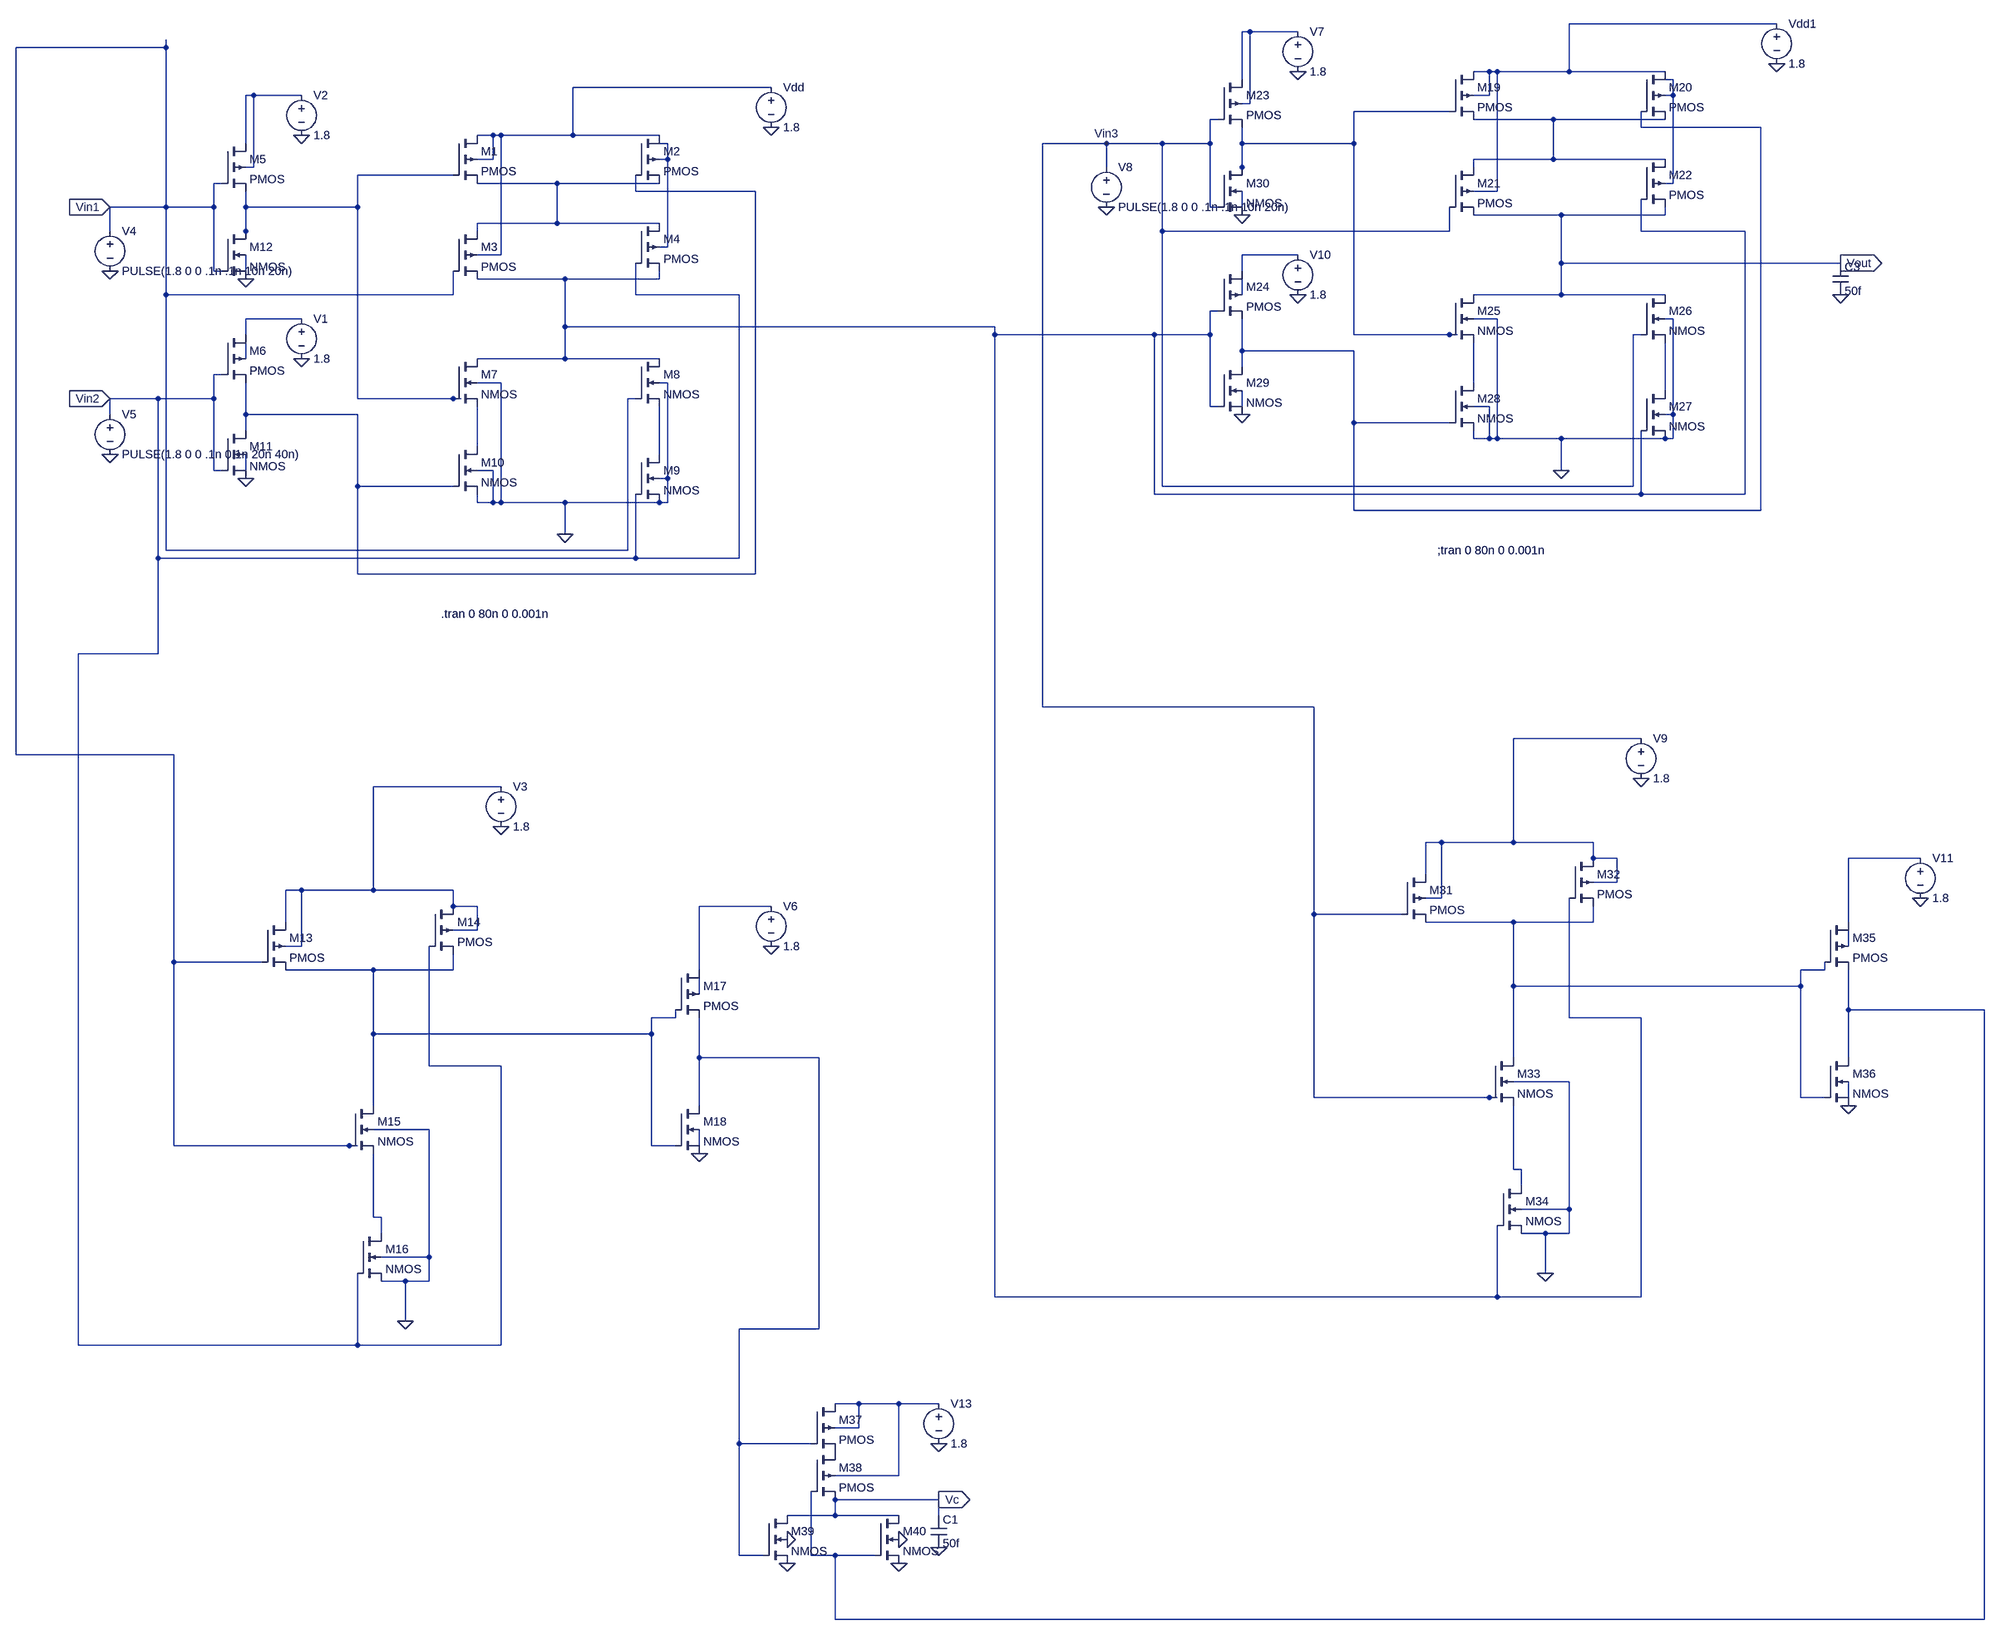
[diagram p0: schematic full_adder.asc]
full_adder.asc, the LTspice schematic file:
Version 4
SHEET 1 3144 2980
WIRE 2688 -304 2272 -304
WIRE 1632 -288 1616 -288
WIRE 1728 -288 1632 -288
WIRE -560 -256 -560 -272
WIRE -560 -256 -944 -256
WIRE 2112 -208 2080 -208
WIRE 2128 -208 2112 -208
WIRE 2272 -208 2272 -304
WIRE 2272 -208 2128 -208
WIRE 2464 -208 2272 -208
WIRE 1616 -192 1616 -288
WIRE 2480 -192 2464 -192
WIRE 672 -176 256 -176
WIRE -384 -160 -400 -160
WIRE -288 -160 -384 -160
WIRE 2112 -160 2112 -208
WIRE 2112 -160 2080 -160
WIRE 2480 -160 2480 -192
WIRE 2480 -160 2464 -160
WIRE 1632 -144 1632 -288
WIRE 1632 -144 1616 -144
WIRE 2032 -128 1840 -128
WIRE 1568 -112 1552 -112
WIRE 2240 -112 2080 -112
WIRE 2464 -112 2240 -112
WIRE 2416 -96 2416 -128
WIRE 2656 -96 2416 -96
WIRE 96 -80 64 -80
WIRE 112 -80 96 -80
WIRE 256 -80 256 -176
WIRE 256 -80 112 -80
WIRE 448 -80 256 -80
WIRE -400 -64 -400 -160
WIRE 464 -64 448 -64
WIRE 1344 -64 1216 -64
WIRE 1456 -64 1344 -64
WIRE 1552 -64 1552 -112
WIRE 1552 -64 1456 -64
WIRE 1616 -64 1616 -96
WIRE 1840 -64 1840 -128
WIRE 1840 -64 1616 -64
WIRE 96 -32 96 -80
WIRE 96 -32 64 -32
WIRE 464 -32 464 -64
WIRE 464 -32 448 -32
WIRE 2240 -32 2240 -112
WIRE 2240 -32 2080 -32
WIRE 2464 -32 2240 -32
WIRE -384 -16 -384 -160
WIRE -384 -16 -400 -16
WIRE 1344 -16 1344 -64
WIRE 1616 -16 1616 -64
WIRE 2080 -16 2080 -32
WIRE 16 0 -176 0
WIRE 1616 0 1616 -16
WIRE -448 16 -464 16
WIRE 224 16 64 16
WIRE 448 16 224 16
WIRE 2480 16 2480 -160
WIRE 2480 16 2464 16
WIRE 400 32 400 0
WIRE 640 32 400 32
WIRE 2128 32 2128 -208
WIRE 2128 32 2080 32
WIRE -560 64 -560 -256
WIRE -560 64 -672 64
WIRE -464 64 -464 16
WIRE -464 64 -560 64
WIRE -400 64 -400 32
WIRE -176 64 -176 0
WIRE -176 64 -400 64
WIRE 1552 64 1552 -64
WIRE 1568 64 1552 64
WIRE 1616 64 1616 32
WIRE 2256 80 2080 80
WIRE 2464 80 2464 64
WIRE 2464 80 2256 80
WIRE 224 96 224 16
WIRE 224 96 64 96
WIRE 448 96 224 96
WIRE -672 112 -672 64
WIRE -400 112 -400 64
WIRE 64 112 64 96
WIRE 1456 112 1456 -64
WIRE 2032 112 2032 64
WIRE 2032 112 1456 112
WIRE 2416 112 2416 48
WIRE 2624 112 2416 112
WIRE -400 128 -400 112
WIRE 464 144 464 -32
WIRE 464 144 448 144
WIRE 112 160 112 -80
WIRE 112 160 64 160
WIRE 1728 160 1616 160
WIRE 2256 176 2256 80
WIRE 2816 176 2256 176
WIRE -464 192 -464 64
WIRE -448 192 -464 192
WIRE -400 192 -400 160
WIRE 1616 192 1616 160
WIRE 240 208 64 208
WIRE 448 208 448 192
WIRE 448 208 240 208
WIRE -560 240 -560 64
WIRE 16 240 16 192
WIRE 16 240 -560 240
WIRE 400 240 400 176
WIRE 608 240 400 240
WIRE 1616 240 1616 208
WIRE 2256 240 2256 176
WIRE 2256 240 2080 240
WIRE 2464 240 2256 240
WIRE 1568 272 1552 272
WIRE -288 288 -400 288
WIRE 2128 288 2080 288
WIRE 2480 288 2464 288
WIRE 240 304 240 208
WIRE 1120 304 240 304
WIRE -400 320 -400 288
WIRE 1120 320 1120 304
WIRE 1440 320 1120 320
WIRE 1552 320 1552 272
WIRE 1552 320 1440 320
WIRE 1840 320 1840 -64
WIRE 2032 320 1840 320
WIRE 2048 320 2032 320
WIRE 2416 320 2400 320
WIRE 1616 352 1616 288
WIRE 1840 352 1616 352
WIRE -400 368 -400 336
WIRE 240 368 240 304
WIRE 240 368 64 368
WIRE 448 368 240 368
WIRE 1616 384 1616 352
WIRE -448 400 -464 400
WIRE 112 416 64 416
WIRE 464 416 448 416
WIRE 2080 416 2080 336
WIRE 2464 432 2464 336
WIRE -576 448 -672 448
WIRE -464 448 -464 400
WIRE -464 448 -576 448
WIRE -176 448 -176 64
WIRE 16 448 -176 448
WIRE 32 448 16 448
WIRE 400 448 384 448
WIRE 1552 464 1552 320
WIRE 1568 464 1552 464
WIRE 1616 464 1616 432
WIRE 2112 464 2080 464
WIRE -672 480 -672 448
WIRE -400 480 -400 416
WIRE -176 480 -400 480
WIRE 2480 480 2480 288
WIRE 2480 480 2464 480
WIRE 1840 496 1840 352
WIRE 2032 496 1840 496
WIRE -400 512 -400 480
WIRE 2080 528 2080 512
WIRE 2112 528 2112 464
WIRE 2112 528 2080 528
WIRE 2128 528 2128 288
WIRE 2128 528 2112 528
WIRE 2256 528 2128 528
WIRE 2464 528 2256 528
WIRE 2480 528 2480 480
WIRE 2480 528 2464 528
WIRE 64 544 64 464
WIRE 448 560 448 464
WIRE -464 592 -464 448
WIRE -448 592 -464 592
WIRE -400 592 -400 560
WIRE 96 592 64 592
WIRE 2256 592 2256 528
WIRE 464 608 464 416
WIRE 464 608 448 608
WIRE -176 624 -176 480
WIRE 16 624 -176 624
WIRE 1456 624 1456 112
WIRE 2400 624 2400 320
WIRE 2400 624 1456 624
WIRE 1440 640 1440 320
WIRE 2416 640 2416 512
WIRE 2416 640 1440 640
WIRE 2624 640 2624 112
WIRE 2624 640 2416 640
WIRE 64 656 64 640
WIRE 96 656 96 592
WIRE 96 656 64 656
WIRE 112 656 112 416
WIRE 112 656 96 656
WIRE 240 656 112 656
WIRE 448 656 240 656
WIRE 464 656 464 608
WIRE 464 656 448 656
WIRE 1840 672 1840 496
WIRE 2656 672 2656 -96
WIRE 2656 672 1840 672
WIRE 240 720 240 656
WIRE -560 752 -560 240
WIRE 384 752 384 448
WIRE 384 752 -560 752
WIRE -576 768 -576 448
WIRE 400 768 400 640
WIRE 400 768 -576 768
WIRE 608 768 608 240
WIRE 608 768 400 768
WIRE -176 800 -176 624
WIRE 640 800 640 32
WIRE 640 800 -176 800
WIRE -576 960 -576 768
WIRE -576 960 -736 960
WIRE 1216 1136 1216 -64
WIRE 1760 1136 1216 1136
WIRE 2416 1200 2160 1200
WIRE -944 1232 -944 -256
WIRE -544 1232 -944 1232
WIRE 112 1296 -144 1296
WIRE 2016 1408 1984 1408
WIRE 2160 1408 2160 1200
WIRE 2160 1408 2016 1408
WIRE 2320 1408 2160 1408
WIRE 2320 1440 2320 1408
WIRE 2368 1440 2320 1440
WIRE 2976 1440 2832 1440
WIRE 1984 1472 1984 1408
WIRE 2368 1488 2368 1440
WIRE 2368 1488 2320 1488
WIRE -288 1504 -320 1504
WIRE -144 1504 -144 1296
WIRE -144 1504 -288 1504
WIRE 16 1504 -144 1504
WIRE 2016 1520 2016 1408
WIRE 2016 1520 1984 1520
WIRE 16 1536 16 1504
WIRE 64 1536 16 1536
WIRE 672 1536 528 1536
WIRE 1760 1552 1760 1136
WIRE 1936 1552 1760 1552
WIRE -320 1568 -320 1504
WIRE 2160 1568 1984 1568
WIRE 2320 1568 2320 1536
WIRE 2320 1568 2160 1568
WIRE 2832 1568 2832 1440
WIRE 64 1584 64 1536
WIRE 64 1584 16 1584
WIRE -288 1616 -288 1504
WIRE -288 1616 -320 1616
WIRE 2832 1616 2832 1584
WIRE -544 1648 -544 1232
WIRE -368 1648 -544 1648
WIRE -144 1664 -320 1664
WIRE 16 1664 16 1632
WIRE 16 1664 -144 1664
WIRE 528 1664 528 1536
WIRE 2784 1664 2784 1648
WIRE 2784 1664 2736 1664
WIRE 2160 1696 2160 1568
WIRE 2736 1696 2736 1664
WIRE 2736 1696 2160 1696
WIRE 528 1712 528 1680
WIRE 2832 1744 2832 1664
WIRE 3104 1744 2832 1744
WIRE 480 1760 480 1744
WIRE 480 1760 432 1760
WIRE 2272 1760 2272 1520
WIRE 2416 1760 2272 1760
WIRE -144 1792 -144 1664
WIRE 432 1792 432 1760
WIRE 432 1792 -144 1792
WIRE 528 1840 528 1760
WIRE 768 1840 528 1840
WIRE 2160 1840 2160 1696
WIRE 2832 1840 2832 1744
WIRE -32 1856 -32 1616
WIRE 112 1856 -32 1856
WIRE 2272 1888 2160 1888
WIRE 1760 1920 1760 1552
WIRE 2112 1920 1760 1920
WIRE 2128 1920 2112 1920
WIRE 2736 1920 2736 1696
WIRE 2784 1920 2736 1920
WIRE 2832 1920 2832 1888
WIRE -144 1936 -144 1792
WIRE 528 1936 528 1840
WIRE -32 1984 -144 1984
WIRE -544 2016 -544 1648
WIRE -192 2016 -544 2016
WIRE -176 2016 -192 2016
WIRE 432 2016 432 1792
WIRE 480 2016 432 2016
WIRE 528 2016 528 1984
WIRE 2160 2064 2160 1936
WIRE 2176 2064 2160 2064
WIRE 2176 2096 2176 2064
WIRE 2272 2144 2272 1888
WIRE 2272 2144 2176 2144
WIRE -144 2160 -144 2032
WIRE -128 2160 -144 2160
WIRE -128 2192 -128 2160
WIRE 2224 2192 2176 2192
WIRE 2272 2192 2272 2144
WIRE 2272 2192 2224 2192
WIRE -32 2240 -32 1984
WIRE -32 2240 -128 2240
WIRE 2224 2272 2224 2192
WIRE -80 2288 -128 2288
WIRE -32 2288 -32 2240
WIRE -32 2288 -80 2288
WIRE 1120 2320 1120 320
WIRE 2128 2320 2128 2176
WIRE 2128 2320 1120 2320
WIRE 2416 2320 2416 1760
WIRE 2416 2320 2128 2320
WIRE -80 2368 -80 2288
WIRE 768 2384 768 1840
WIRE 768 2384 608 2384
WIRE -736 2416 -736 960
WIRE -176 2416 -176 2272
WIRE -176 2416 -736 2416
WIRE 112 2416 112 1856
WIRE 112 2416 -176 2416
WIRE 848 2544 800 2544
WIRE 928 2544 848 2544
WIRE 1008 2544 928 2544
WIRE 848 2592 848 2544
WIRE 848 2592 800 2592
WIRE 608 2624 608 2384
WIRE 752 2624 608 2624
WIRE 928 2688 928 2544
WIRE 928 2688 800 2688
WIRE 1008 2736 800 2736
WIRE 800 2768 800 2736
WIRE 800 2768 704 2768
WIRE 928 2768 800 2768
WIRE 1008 2768 1008 2736
WIRE 608 2848 608 2624
WIRE 656 2848 608 2848
WIRE 752 2848 752 2720
WIRE 800 2848 752 2848
WIRE 880 2848 800 2848
WIRE 800 2976 800 2848
WIRE 3104 2976 3104 1744
WIRE 3104 2976 800 2976
FLAG 240 720 0
FLAG 672 -96 0
FLAG -400 608 0
FLAG -400 208 0
FLAG -288 -80 0
FLAG -288 368 0
FLAG -672 560 0
FLAG -672 192 0
FLAG -672 64 Vin1
IOPIN -672 64 In
FLAG -672 448 Vin2
IOPIN -672 448 In
FLAG 112 1376 0
FLAG -80 2368 0
FLAG 528 2032 0
FLAG 672 1616 0
FLAG 2256 592 0
FLAG 2688 -224 0
FLAG 1616 480 0
FLAG 1616 80 0
FLAG 1728 -208 0
FLAG 1728 240 0
FLAG 1344 64 0
FLAG 2816 240 0
FLAG 2816 176 Vout
IOPIN 2816 176 Out
FLAG 1344 -64 Vin3
FLAG 2416 1280 0
FLAG 2224 2272 0
FLAG 2832 1936 0
FLAG 2976 1520 0
FLAG 704 2864 0
FLAG 704 2816 0
FLAG 928 2816 0
FLAG 928 2864 0
FLAG 1008 2624 0
FLAG 1008 2832 0
FLAG 1008 2736 Vc
IOPIN 1008 2736 Out
SYMBOL pmos4 16 -80 R0
SYMATTR InstName M1
SYMATTR Value2 l=180nm w=810nm
SYMBOL pmos4 400 -80 R0
SYMATTR InstName M2
SYMATTR Value2 l=180nm w=810nm
SYMBOL pmos4 16 112 R0
SYMATTR InstName M3
SYMATTR Value2 l=180nm w=810nm
SYMBOL pmos4 400 96 R0
SYMATTR InstName M4
SYMATTR Value2 l=180nm w=810nm
SYMBOL pmos4 -448 -64 R0
SYMATTR InstName M5
SYMATTR Value2 l=180nm w=810nm
SYMBOL pmos4 -448 320 R0
SYMATTR InstName M6
SYMATTR Value2 l=180nm w=810nm
SYMBOL nmos4 16 368 R0
SYMATTR InstName M7
SYMATTR Value2 l=180nm w=270nm
SYMBOL nmos4 400 368 R0
SYMATTR InstName M8
SYMATTR Value2 l=180nm w=270nm
SYMBOL nmos4 400 560 R0
SYMATTR InstName M9
SYMATTR Value2 l=180nm w=270nm
SYMBOL nmos4 16 544 R0
SYMATTR InstName M10
SYMATTR Value2 l=180nm w=270nm
SYMBOL nmos4 -448 512 R0
SYMATTR InstName M11
SYMATTR Value2 l=180nm w=270nm
SYMBOL nmos4 -448 112 R0
SYMATTR InstName M12
SYMATTR Value2 l=180nm w=270nm
SYMBOL voltage 672 -192 R0
WINDOW 123 0 0 Left 0
WINDOW 39 0 0 Left 0
SYMATTR InstName Vdd
SYMATTR Value 1.8
SYMBOL voltage -288 -176 R0
WINDOW 123 0 0 Left 0
WINDOW 39 0 0 Left 0
SYMATTR InstName V2
SYMATTR Value 1.8
SYMBOL voltage -672 96 R0
WINDOW 123 0 0 Left 0
WINDOW 39 0 0 Left 0
SYMATTR InstName V4
SYMATTR Value PULSE(1.8 0 0 .1n .1n 10n 20n)
SYMBOL voltage -672 464 R0
WINDOW 123 0 0 Left 0
WINDOW 39 0 0 Left 0
SYMATTR InstName V5
SYMATTR Value PULSE(1.8 0 0 .1n 0.1n 20n 40n)
SYMBOL voltage -288 272 R0
WINDOW 123 0 0 Left 0
WINDOW 39 0 0 Left 0
SYMATTR InstName V1
SYMATTR Value 1.8
SYMBOL pmos4 -368 1568 R0
SYMATTR InstName M13
SYMATTR Value2 l=180n w=810n
SYMBOL pmos4 -32 1536 R0
SYMATTR InstName M14
SYMATTR Value2 l=180n w=810n
SYMBOL nmos4 -192 1936 R0
SYMATTR InstName M15
SYMATTR Value2 l=180n w=270n
SYMBOL nmos4 -176 2192 R0
SYMATTR InstName M16
SYMATTR Value2 l=180n w=270n
SYMBOL voltage 112 1280 R0
WINDOW 123 0 0 Left 0
WINDOW 39 0 0 Left 0
SYMATTR InstName V3
SYMATTR Value 1.8
SYMBOL pmos4 480 1664 R0
SYMATTR InstName M17
SYMATTR Value2 l=180n w=810n
SYMBOL nmos4 480 1936 R0
SYMATTR InstName M18
SYMATTR Value2 l=180n w=270n
SYMBOL voltage 672 1520 R0
WINDOW 123 0 0 Left 0
WINDOW 39 0 0 Left 0
SYMATTR InstName V6
SYMATTR Value 1.8
SYMBOL pmos4 2032 -208 R0
SYMATTR InstName M19
SYMATTR Value2 l=180nm w=810nm
SYMBOL pmos4 2416 -208 R0
SYMATTR InstName M20
SYMATTR Value2 l=180nm w=810nm
SYMBOL pmos4 2032 -16 R0
SYMATTR InstName M21
SYMATTR Value2 l=180nm w=810nm
SYMBOL pmos4 2416 -32 R0
SYMATTR InstName M22
SYMATTR Value2 l=180nm w=810nm
SYMBOL pmos4 1568 -192 R0
SYMATTR InstName M23
SYMATTR Value2 l=180nm w=810nm
SYMBOL pmos4 1568 192 R0
SYMATTR InstName M24
SYMATTR Value2 l=180nm w=810nm
SYMBOL nmos4 2032 240 R0
SYMATTR InstName M25
SYMATTR Value2 l=180nm w=270nm
SYMBOL nmos4 2416 240 R0
SYMATTR InstName M26
SYMATTR Value2 l=180nm w=270nm
SYMBOL nmos4 2416 432 R0
SYMATTR InstName M27
SYMATTR Value2 l=180nm w=270nm
SYMBOL nmos4 2032 416 R0
SYMATTR InstName M28
SYMATTR Value2 l=180nm w=270nm
SYMBOL nmos4 1568 384 R0
SYMATTR InstName M29
SYMATTR Value2 l=180nm w=270nm
SYMBOL nmos4 1568 -16 R0
SYMATTR InstName M30
SYMATTR Value2 l=180nm w=270nm
SYMBOL voltage 2688 -320 R0
WINDOW 123 0 0 Left 0
WINDOW 39 0 0 Left 0
SYMATTR InstName Vdd1
SYMATTR Value 1.8
SYMBOL voltage 1728 -304 R0
WINDOW 123 0 0 Left 0
WINDOW 39 0 0 Left 0
SYMATTR InstName V7
SYMATTR Value 1.8
SYMBOL voltage 1344 -32 R0
WINDOW 123 0 0 Left 0
WINDOW 39 0 0 Left 0
SYMATTR InstName V8
SYMATTR Value PULSE(1.8 0 0 .1n .1n 10n 20n)
SYMBOL cap 2800 176 R0
SYMATTR InstName C3
SYMATTR Value 50f
SYMBOL voltage 1728 144 R0
WINDOW 123 0 0 Left 0
WINDOW 39 0 0 Left 0
SYMATTR InstName V10
SYMATTR Value 1.8
SYMBOL pmos4 1936 1472 R0
SYMATTR InstName M31
SYMATTR Value2 l=180n w=810n
SYMBOL pmos4 2272 1440 R0
SYMATTR InstName M32
SYMATTR Value2 l=180n w=810n
SYMBOL nmos4 2112 1840 R0
SYMATTR InstName M33
SYMATTR Value2 l=180n w=270n
SYMBOL nmos4 2128 2096 R0
SYMATTR InstName M34
SYMATTR Value2 l=180n w=270n
SYMBOL voltage 2416 1184 R0
WINDOW 123 0 0 Left 0
WINDOW 39 0 0 Left 0
SYMATTR InstName V9
SYMATTR Value 1.8
SYMBOL pmos4 2784 1568 R0
SYMATTR InstName M35
SYMATTR Value2 l=180n w=810n
SYMBOL nmos4 2784 1840 R0
SYMATTR InstName M36
SYMATTR Value2 l=180n w=270n
SYMBOL voltage 2976 1424 R0
WINDOW 123 0 0 Left 0
WINDOW 39 0 0 Left 0
SYMATTR InstName V11
SYMATTR Value 1.8
SYMBOL pmos4 752 2544 R0
SYMATTR InstName M37
SYMATTR Value2 l=180nm w=810nm
SYMBOL pmos4 752 2640 R0
SYMATTR InstName M38
SYMATTR Value2 l=180nm w=810nm
SYMBOL nmos4 656 2768 R0
SYMATTR InstName M39
SYMATTR Value2 l=180nm w=270nm
SYMBOL nmos4 880 2768 R0
SYMATTR InstName M40
SYMATTR Value2 l=180nm w=270nm
SYMBOL voltage 1008 2528 R0
WINDOW 123 0 0 Left 0
WINDOW 39 0 0 Left 0
SYMATTR InstName V13
SYMATTR Value 1.8
SYMBOL cap 992 2768 R0
SYMATTR InstName C1
SYMATTR Value 50f
TEXT -8 880 Left 2 !.tran 0 80n 0 0.001n
TEXT 2008 752 Left 2 !;tran 0 80n 0 0.001n

The netlist it stands for:
* full_adder.asc
M1 N004 N010 N011 N004 PMOS l=180nm w=810nm
M2 N004 N012 N011 N009 PMOS l=180nm w=810nm
M3 N011 Vin1 N014 N004 PMOS l=180nm w=810nm
M4 N011 Vin2 N014 N009 PMOS l=180nm w=810nm
M5 N005 Vin1 N010 N005 PMOS l=180nm w=810nm
M6 N018 Vin2 N012 N019 PMOS l=180nm w=810nm
M7 N014 N010 N023 0 NMOS l=180nm w=270nm
M8 N014 Vin1 N024 0 NMOS l=180nm w=270nm
M9 N024 Vin2 0 0 NMOS l=180nm w=270nm
M10 N023 N012 0 0 NMOS l=180nm w=270nm
M11 N012 Vin2 0 N025 NMOS l=180nm w=270nm
M12 N010 Vin1 0 N016 NMOS l=180nm w=270nm
Vdd N004 0 1.8
V2 N005 0 1.8
V4 Vin1 0 PULSE(1.8 0 0 .1n .1n 10n 20n)
V5 Vin2 0 PULSE(1.8 0 0 .1n 0.1n 20n 40n)
V1 N018 0 1.8
M13 N027 Vin1 N032 N027 PMOS l=180n w=810n
M14 N027 Vin2 N032 N027 PMOS l=180n w=810n
M15 N032 Vin1 N039 0 NMOS l=180n w=270n
M16 N039 Vin2 0 0 NMOS l=180n w=270n
V3 N027 0 1.8
M17 N029 N032 N035 N033 PMOS l=180n w=810n
M18 N035 N032 0 N037 NMOS l=180n w=270n
V6 N029 0 1.8
M19 N001 N006 N007 N001 PMOS l=180nm w=810nm
M20 N001 N008 N007 N003 PMOS l=180nm w=810nm
M21 N007 Vin3 Vout N001 PMOS l=180nm w=810nm
M22 N007 N014 Vout N003 PMOS l=180nm w=810nm
M23 N002 Vin3 N006 N002 PMOS l=180nm w=810nm
M24 N015 N014 N008 N017 PMOS l=180nm w=810nm
M25 Vout N006 N020 0 NMOS l=180nm w=270nm
M26 Vout Vin3 N021 0 NMOS l=180nm w=270nm
M27 N021 N014 0 0 NMOS l=180nm w=270nm
M28 N020 N008 0 0 NMOS l=180nm w=270nm
M29 N008 N014 0 N022 NMOS l=180nm w=270nm
M30 N006 Vin3 0 N013 NMOS l=180nm w=270nm
Vdd1 N001 0 1.8
V7 N002 0 1.8
V8 Vin3 0 PULSE(1.8 0 0 .1n .1n 10n 20n)
C3 Vout 0 50f
V10 N015 0 1.8
M31 N026 Vin3 N030 N026 PMOS l=180n w=810n
M32 N026 N014 N030 N026 PMOS l=180n w=810n
M33 N030 Vin3 N038 0 NMOS l=180n w=270n
M34 N038 N014 0 0 NMOS l=180n w=270n
V9 N026 0 1.8
M35 N028 N030 N034 N031 PMOS l=180n w=810n
M36 N034 N030 0 N036 NMOS l=180n w=270n
V11 N028 0 1.8
M37 N040 N035 P001 N040 PMOS l=180nm w=810nm
M38 P001 N034 Vc N040 PMOS l=180nm w=810nm
M39 Vc N035 0 0 NMOS l=180nm w=270nm
M40 Vc N034 0 0 NMOS l=180nm w=270nm
V13 N040 0 1.8
C1 Vc 0 50f
.model NMOS NMOS
.model PMOS PMOS
.lib standard.mos
.tran 0 80n 0 0.001n
;tran 0 80n 0 0.001n
.backanno
.end